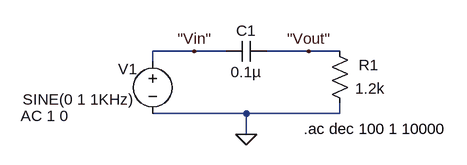
[diagram p0: schematic High Pass .asc]
High Pass .asc, the LTspice schematic file:
Version 4
SHEET 1 880 680
WIRE 64 -288 0 -288
WIRE 112 -288 64 -288
WIRE 240 -288 176 -288
WIRE 288 -288 240 -288
WIRE 0 -272 0 -288
WIRE 144 -192 0 -192
WIRE 288 -192 288 -208
WIRE 288 -192 144 -192
WIRE 144 -160 144 -192
FLAG 240 -288 "Vout"
FLAG 144 -160 0
FLAG 64 -288 "Vin"
SYMBOL res 304 -192 R180
WINDOW 0 -44 75 Left 2
WINDOW 3 -53 39 Left 2
SYMATTR InstName R1
SYMATTR Value 1.2k
SYMBOL cap 112 -272 R270
WINDOW 0 32 32 VTop 2
WINDOW 3 0 32 VBottom 2
SYMATTR InstName C1
SYMATTR Value 0.1µ
SYMBOL voltage 0 -288 R0
WINDOW 0 -53 27 Left 2
WINDOW 3 -200 74 Left 2
WINDOW 123 -203 100 Left 2
SYMATTR InstName V1
SYMATTR Value SINE(0 1 1KHz)
SYMATTR Value2 AC 1 0
TEXT 232 -168 Left 2 !.ac dec 100 1 10000

The netlist it stands for:
* High Pass .asc
R1 0 "Vout" 1.2k
C1 "Vin" "Vout" 0.1µ
V1 "Vin" 0 SINE(0 1 1KHz) AC 1 0
.ac dec 100 1 10000
.backanno
.end